# EAGLE design Knob (EAGLE 7.1.0)
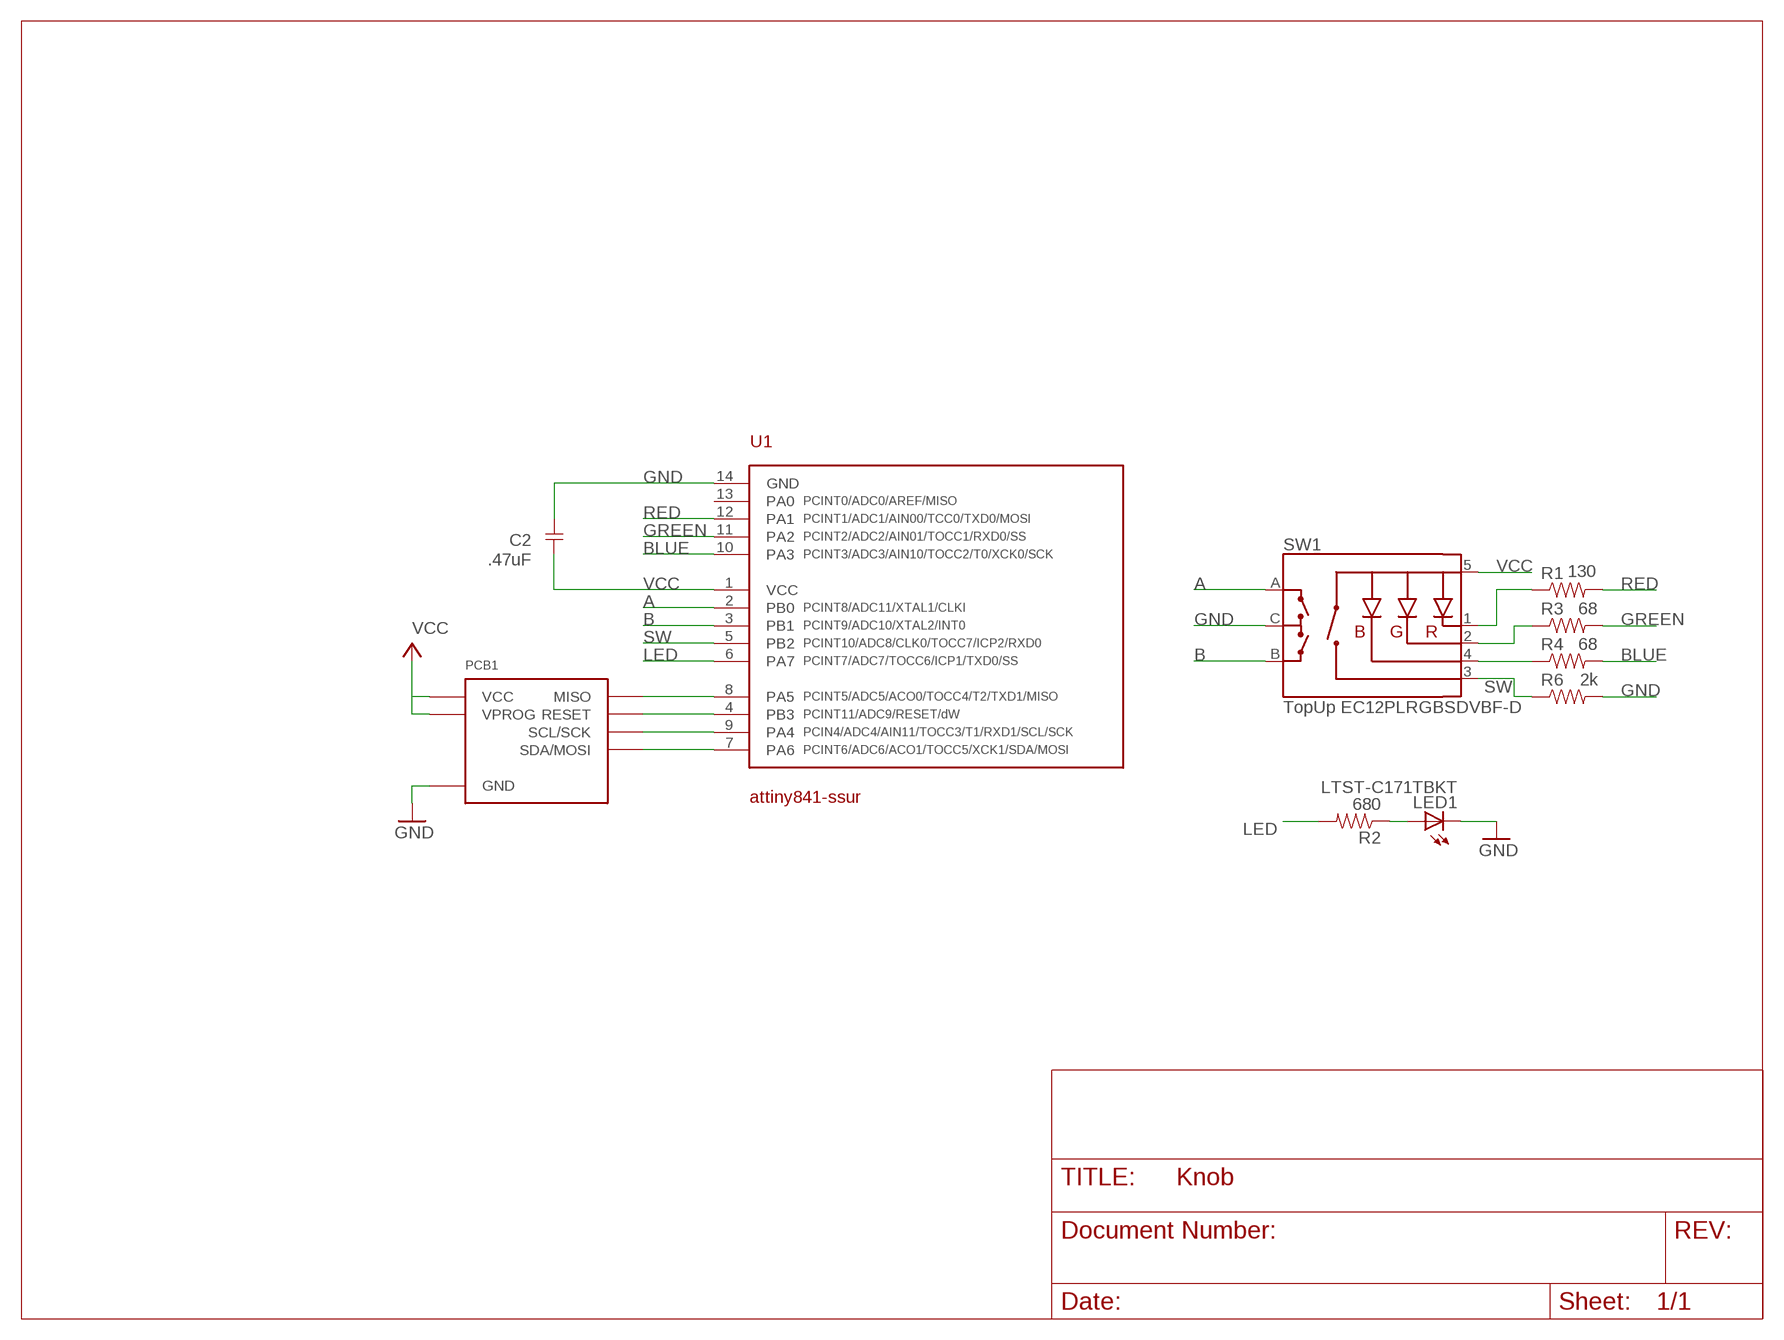
[diagram p0: schematic, sheet 1]

## Parts
C2  .47uF  CAPACITOR  [0805]
LED1  LTST-C171TBKT  LED-0805-BLUE  [0805-LED]
PCB1  MAGDEVICE  [MAGDEVICE]
R1  130  RESISTOR  [0805]
R2  680  RESISTOR  [0805]
R3  68  RESISTOR  [0805]
R4  68  RESISTOR  [0805]
R6  2k  RESISTOR  [0805]
SW1  TopUp EC12PLRGBSDVBF-D  ENCODER_RGB_CA  [ENCODER_LED_3]
U1  attiny841-ssur  ATTINY841  [SOIC14]

## Nets
A: SW1.A U1.2(PB0)
B: SW1.B U1.3(PB1)
BLUE: R4.2 U1.10(PA3)
GND: C2.2 LED1.C PCB1.GNDA(GND) PCB1.GNDB(GND) R6.2 SW1.C U1.14(GND)
GREEN: R3.2 U1.11(PA2)
LED: R2.2 U1.6(PA7)
MISO: PCB1.MISO U1.8(PA5)
N$4: R1.1 SW1.1(-R)
N$5: R3.1 SW1.2(-G)
N$6: R4.1 SW1.4(-B)
N$7: LED1.A R2.1
RED: R1.2 U1.12(PA1)
RESET: PCB1.RESET U1.4(PB3)
SCL/SCK: PCB1.SCLA(SCL/SCK) PCB1.SCLB(SCL/SCK) U1.9(PA4)
SDA/MOSI: PCB1.SDAA(SDA/MOSI) PCB1.SDAB(SDA/MOSI) U1.7(PA6)
SW: R6.1 SW1.3(SW) U1.5(PB2)
VCC: C2.1 PCB1.VCCA(VCC) PCB1.VCCB(VCC) PCB1.VPROG SW1.5(+) U1.1(VCC)
Unconnected: U1.13(PA0)

## Library data of the parts
C2 = Modulo:CAPACITOR: Capacitor
LED1 = Modulo:LED: LED
PCB1 = Modulo:MAGDEVICE
R1-R4 R6 = Modulo:RESISTOR: Resistor Basic schematic elements and footprints for 0603, 1206, and PTH resistors.
SW1 = SparkFun-Electromechanical:ENCODER_RGB_CA: Illuminated Rotary Encoder w/ RGB LED and select switch EC12PLRGBSDVBF-D: http://top-up.so-buy.com/front/bin/ptdetail.phtml?Part=EC12PLRGBSDVBF-D
U1 = IntegerLabs:ATTINY841

## Board
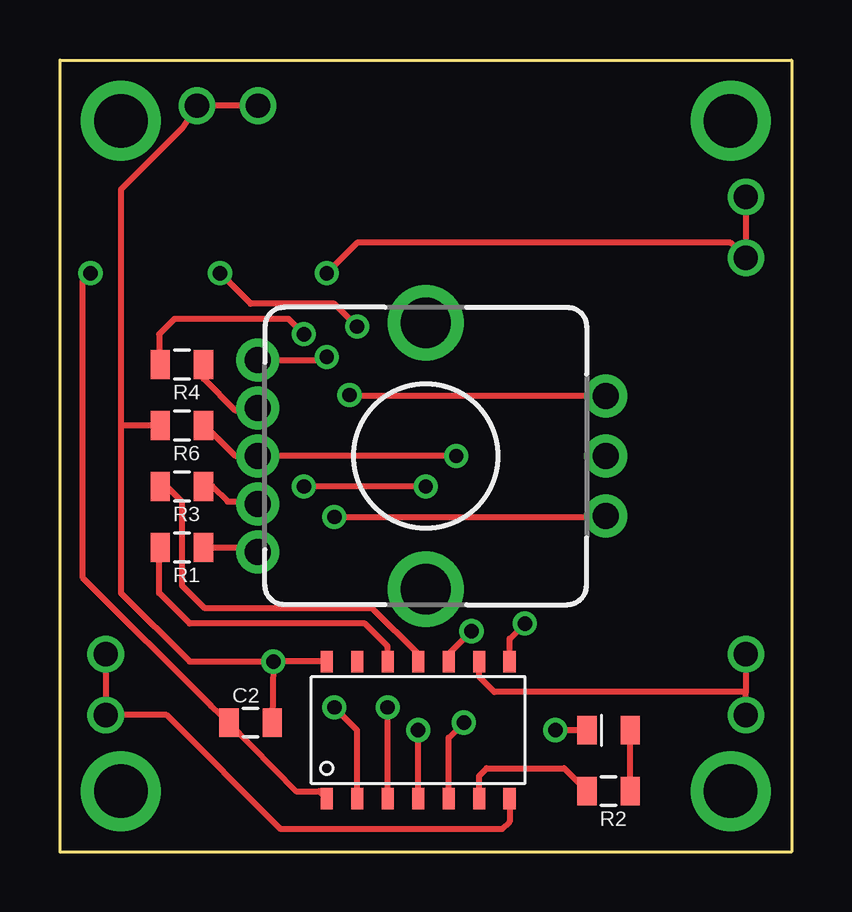
[diagram p1: board, top side]
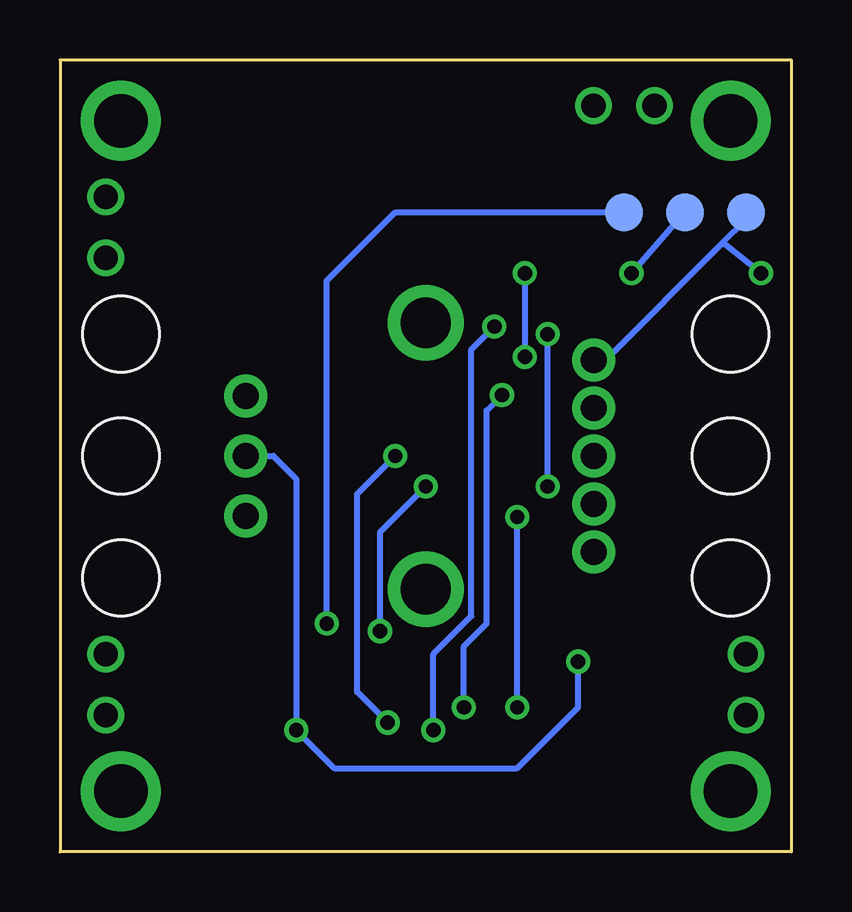
[diagram p2: board, bottom side, seen from below]

Size 30.48 x 33.02 mm. Coordinates in mm from the lower left corner, seen from the top.
Copper layers (1*16): Top 0.0178mm / dielectric 59mil / Bottom 0.0178mm
Design rules "SSC-EAGLE-2Lyr_v1.0.0.3 *": minimum track width 6mil, minimum drill 14mil, track to track 6mil, track to pad 6mil, pad to pad 6mil, via to via 6mil, smd to smd 6mil, copper to edge 20mil, drill to drill 16mil, minimum pad ring 8mil, minimum via ring 8mil, stop-mask expansion 3mil, vias tented up to drill 25mil, thermal gap 10mil

### Footprints (pad centres in the part's own frame; a part is rotated, then mirrored left to right if it is on the bottom)
0805 = smd 0.8 x 1.2: 1 -0.9,0; 2 0.9,0
0805-LED = smd 1.2 x 0.8: A 0,-0.9; C 0,0.9
MAGDEVICE = drill 1.016: GNDA 5.715,31.115; GNDB 8.255,31.115; SCLA 28.575,5.715; SCLB 28.575,8.255; SDAA 1.905,5.715; SDAB 1.905,8.255; VCCA 28.575,27.305; VCCB 28.575,24.765 | drill 2.223: H1 2.54,30.48; H2 2.54,2.54; H3 27.94,30.48; H4 27.94,2.54 | smd 1.587 x 1.587 bottom: MISO 6.985,26.67; RESET 4.445,26.67; VPROG 1.905,26.67
ENCODER_LED_3 = drill 1.1 pad 1.778: 1 -4,7; 2 -2,7; 3 0,7; 4 2,7; 5 4,7 | drill 1.1 pad 1.8: A -2.5,-7.5; B 2.5,-7.5; C 0,-7.5 | drill 2.1: M1 -5.55,0; M2 5.55,0
SOIC14 = smd 0.508 x 0.889: 1 0,-3.175; 2 1.27,-3.175; 3 2.54,-3.175; 4 3.81,-3.175; 5 5.08,-3.175; 6 6.35,-3.175; 7 7.62,-3.175; 8 7.62,2.54; 9 6.35,2.54; 10 5.08,2.54; 11 3.81,2.54; 12 2.54,2.54; 13 1.27,2.54; 14 0,2.54

### Placement (x,y rotation side)
C2  7.94,5.4 0 top
LED1  22.86,5.08 90 top
PCB1  0,0 0 top
R1  5.08,12.7 180 top
R2  22.86,2.54 180 top
R3  5.08,15.24 180 top
R4  5.08,20.32 180 top
R6  5.08,17.78 180 top
SW1  15.24,16.51 90 top
U1  11.11,5.4 0 top

### Tracks (layer width: path | path; a pad name or v marks a point on that pad's centre or on a via)
A  (via drill 0.6)
  Top 0.254: U1.2 12.38,5.08 v11.43,6.03 | v11.43,13.97 22.7,13.97 SW1.A
  Bottom 0.254: v11.43,6.03 v11.43,13.97
B  (via drill 0.6)
  Top 0.254: U1.3 v13.65,6.03 | SW1.B 12.11,19.01 v12.06,19.05
  Bottom 0.254: v13.65,6.03 13.65,8.57 12.7,9.53 12.7,18.41 v12.06,19.05
BLUE  (via drill 0.6)
  Top 0.254: U1.10 16.19,8.26 v17.14,9.21 | v15.24,15.24 v10.16,15.24 | v10.16,21.59 9.53,22.23 4.76,22.23 4.13,21.59 4.13,20.37 R4.2
  Bottom 0.254: v17.14,9.21 17.14,13.34 v15.24,15.24 | v10.16,15.24 v10.16,21.59
GND  (via drill 0.6)
  Top 0.254: LED1.C v20.64,5.08 | U1.14 v8.89,7.94 | v8.89,7.94 C2.2 | R6.2 2.54,17.78 | 2.54,17.78 2.54,10.79 5.4,7.94 v8.89,7.94 | PCB1.GNDB PCB1.GNDA 5.08,30.16 2.54,27.62 2.54,17.78
  Bottom 0.254: v8.89,7.94 8.89,6.03 11.43,3.49 19.05,3.49 v20.64,5.08 20.64,15.56 21.59,16.51 SW1.C
GREEN
  Top 0.254: U1.11 14.92,8.26 13.02,10.16 6.03,10.16 5.08,11.11 5.08,14.61 4.45,15.24 R3.2
LED
  Top 0.254: U1.6 17.46,3.17 17.78,3.49 21.01,3.49 R2.2
MISO  (via drill 0.6)
  Top 0.254: U1.8 18.73,8.89 v19.37,9.53
  Bottom 0.254: v19.37,9.53 19.37,23.81 16.51,26.67 PCB1.MISO
N$4
  Top 0.254: R1.1 8.05,12.7 SW1.1
N$5
  Top 0.254: R3.1 6.35,15.24 6.99,14.61 8.02,14.61 SW1.2
N$6
  Top 0.254: R4.1 5.98,19.74 7.3,18.41 8.14,18.41 SW1.4
N$7
  Top 0.254: R2.1 LED1.A
RED
  Top 0.254: U1.12 13.65,8.57 12.7,9.53 5.4,9.53 4.13,10.79 4.13,12.65 R1.2
RESET  (via drill 0.6)
  Top 0.254: U1.4 v14.92,5.08 | v12.38,21.91 11.43,22.86 7.94,22.86 v6.67,24.13
  Bottom 0.254: v14.92,5.08 14.92,8.26 13.34,9.84 13.34,20.95 v12.38,21.91 | v6.67,24.13 PCB1.RESET
SCL/SCK
  Top 0.254: PCB1.SCLA 28.57,6.67 | PCB1.SCLB 28.57,6.67 | 28.57,6.67 18.1,6.67 17.46,7.3 U1.9
SDA/MOSI
  Top 0.254: PCB1.SDAB PCB1.SDAA 4.45,5.71 9.21,0.95 18.41,0.95 18.73,1.27 U1.7
SW  (via drill 0.6)
  Top 0.254: U1.5 16.19,4.76 v16.83,5.4 | R6.1 6.03,17.78 7.3,16.51 SW1.3 v16.51,16.51
  Bottom 0.254: v16.83,5.4 18.1,6.67 18.1,14.92 v16.51,16.51
VCC  (via drill 0.6)
  Top 0.254: U1.1 10.79,2.54 9.84,2.54 C2.1 6.3,6.08 0.95,11.43 0.95,23.81 v1.27,24.13 | v11.11,24.13 12.38,25.4 27.94,25.4 PCB1.VCCB PCB1.VCCA | SW1.5 10.98,20.51 v11.11,20.64
  Bottom 0.254: SW1.5 7.75,20.51 2.86,25.4 | 2.86,25.4 1.91,26.35 PCB1.VPROG | v11.11,24.13 11.11,20.51 10.98,20.51 v11.11,20.64 | v1.27,24.13 2.86,25.4